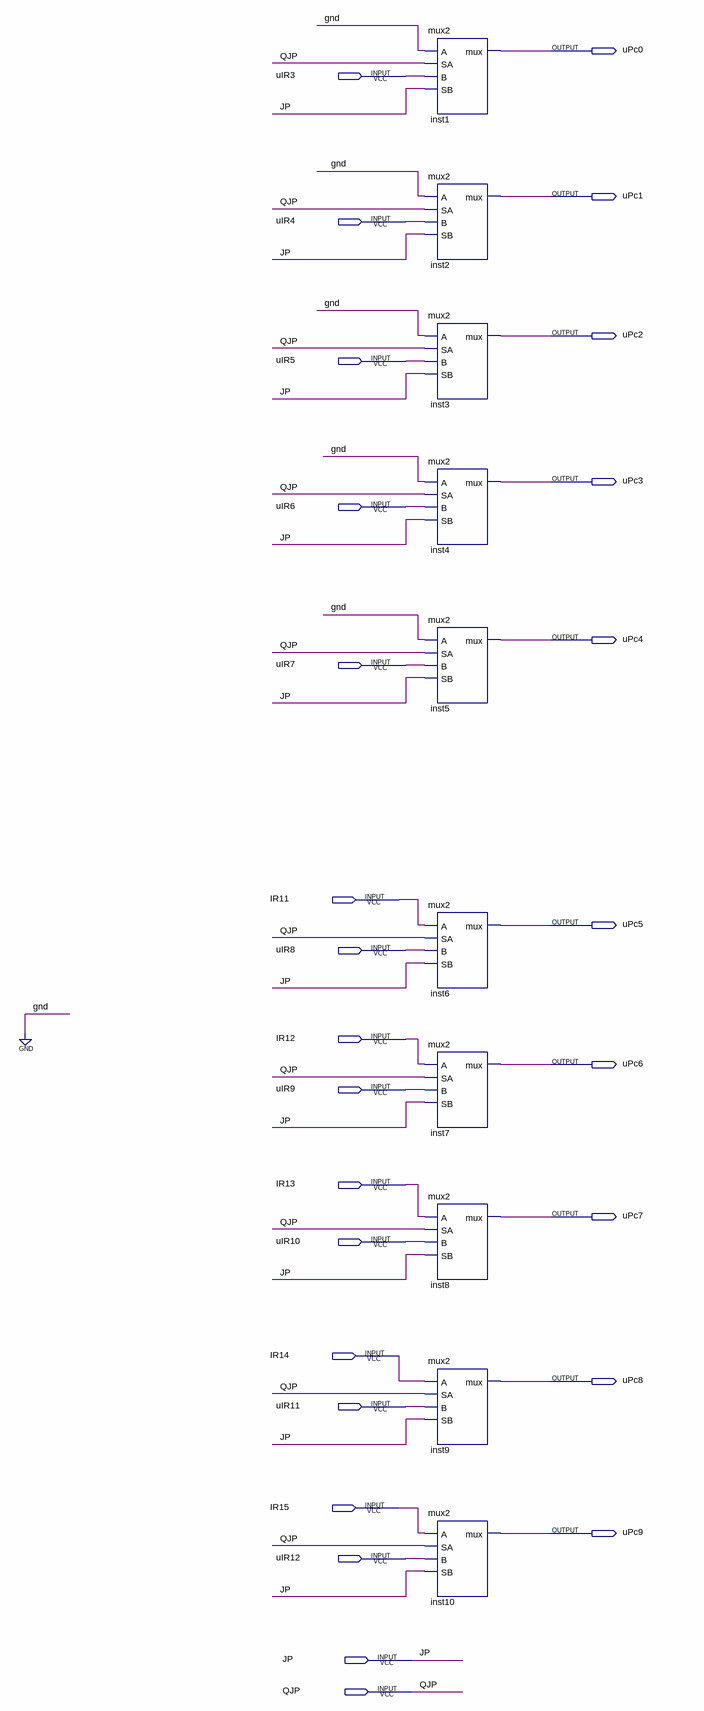
[diagram p0: schematic sheet]
// Quartus schematic houji.bdf as structural Verilog: 10 symbols, 27 pins
module houji (
  input  uIR3,
  input  uIR4,
  input  uIR5,
  input  uIR6,
  input  uIR7,
  input  IR11,
  input  uIR8,
  input  IR12,
  input  uIR9,
  input  IR13,
  input  uIR10,
  input  IR14,
  input  uIR11,
  input  IR15,
  input  uIR12,
  input  JP,
  input  QJP,
  output uPc0,
  output uPc1,
  output uPc2,
  output uPc3,
  output uPc4,
  output uPc5,
  output uPc6,
  output uPc7,
  output uPc8,
  output uPc9
);

  mux2 inst1 (.A(1'b0), .SA(QJP), .B(uIR3), .SB(JP), .mux(uPc0));
  mux2 inst2 (.A(1'b0), .SA(QJP), .B(uIR4), .SB(JP), .mux(uPc1));
  mux2 inst3 (.A(1'b0), .SA(QJP), .B(uIR5), .SB(JP), .mux(uPc2));
  mux2 inst4 (.A(1'b0), .SA(QJP), .B(uIR6), .SB(JP), .mux(uPc3));
  mux2 inst5 (.A(1'b0), .SA(QJP), .B(uIR7), .SB(JP), .mux(uPc4));
  mux2 inst6 (.A(IR11), .SA(QJP), .B(uIR8), .SB(JP), .mux(uPc5));
  mux2 inst7 (.A(IR12), .SA(QJP), .B(uIR9), .SB(JP), .mux(uPc6));
  mux2 inst8 (.A(IR13), .SA(QJP), .B(uIR10), .SB(JP), .mux(uPc7));
  mux2 inst9 (.A(IR14), .SA(QJP), .B(uIR11), .SB(JP), .mux(uPc8));
  mux2 inst10 (.A(IR15), .SA(QJP), .B(uIR12), .SB(JP), .mux(uPc9));
endmodule
